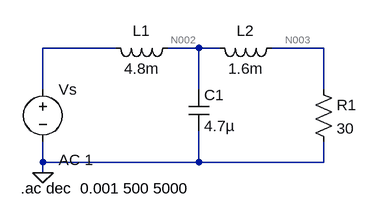
[diagram p0: schematic (3).asc]
(3).asc, the LTspice schematic file:
Version 4
SHEET 1 880 680
WIRE 112 48 0 48
WIRE 240 48 192 48
WIRE 272 48 240 48
WIRE 432 48 352 48
WIRE 0 112 0 48
WIRE 240 112 240 48
WIRE 432 112 432 48
WIRE 0 224 0 192
WIRE 240 224 240 176
WIRE 240 224 0 224
WIRE 432 224 432 192
WIRE 432 224 240 224
WIRE 0 240 0 224
FLAG 0 240 0
SYMBOL voltage 0 96 R0
WINDOW 123 24 124 Left 2
WINDOW 39 0 0 Left 2
SYMATTR InstName Vs
SYMATTR Value ""
SYMATTR Value2 AC 1
SYMBOL ind 208 32 R90
WINDOW 0 5 56 VBottom 2
WINDOW 3 32 56 VTop 2
SYMATTR InstName L1
SYMATTR Value 4.8m
SYMBOL ind 368 32 R90
WINDOW 0 5 56 VBottom 2
WINDOW 3 32 56 VTop 2
SYMATTR InstName L2
SYMATTR Value 1.6m
SYMBOL res 416 96 R0
SYMATTR InstName R1
SYMATTR Value 30
SYMBOL cap 224 112 R0
SYMATTR InstName C1
SYMATTR Value 4.7µ
TEXT -34 264 Left 2 !.ac dec  0.001 500 5000

The netlist it stands for:
* (3).asc
Vs N001 0 AC 1
L1 N002 N001 4.8m
L2 N003 N002 1.6m
R1 N003 0 30
C1 N002 0 4.7µ
.ac dec  0.001 500 5000
.backanno
.end

* Results of the author's LTspice run, read from the files saved beside the schematic
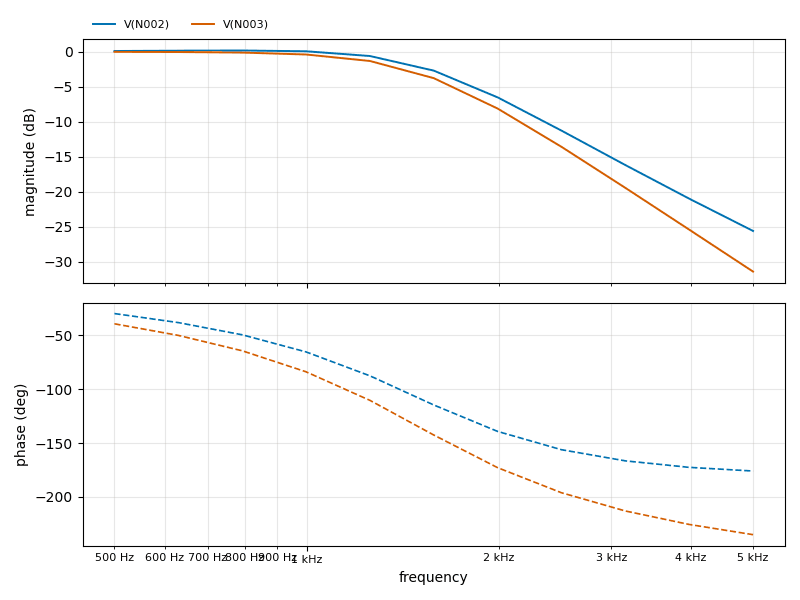
[diagram p1: AC Analysis of (3).asc, plotted from the saved traces]
* AC Analysis, 1 run:
*   V(N002): 0.10 dB at 500 Hz, -25.62 dB at 5 kHz, peak 0.17 dB at 792.4 Hz, 3 dB below the peak at 1.594 kHz
*   V(N003): -0.02 dB at 500 Hz, -31.43 dB at 5 kHz, peak -0.02 dB at 500 Hz, 3 dB below the peak at 1.474 kHz